# Altium schematic sheet Power.SchDoc
size A4
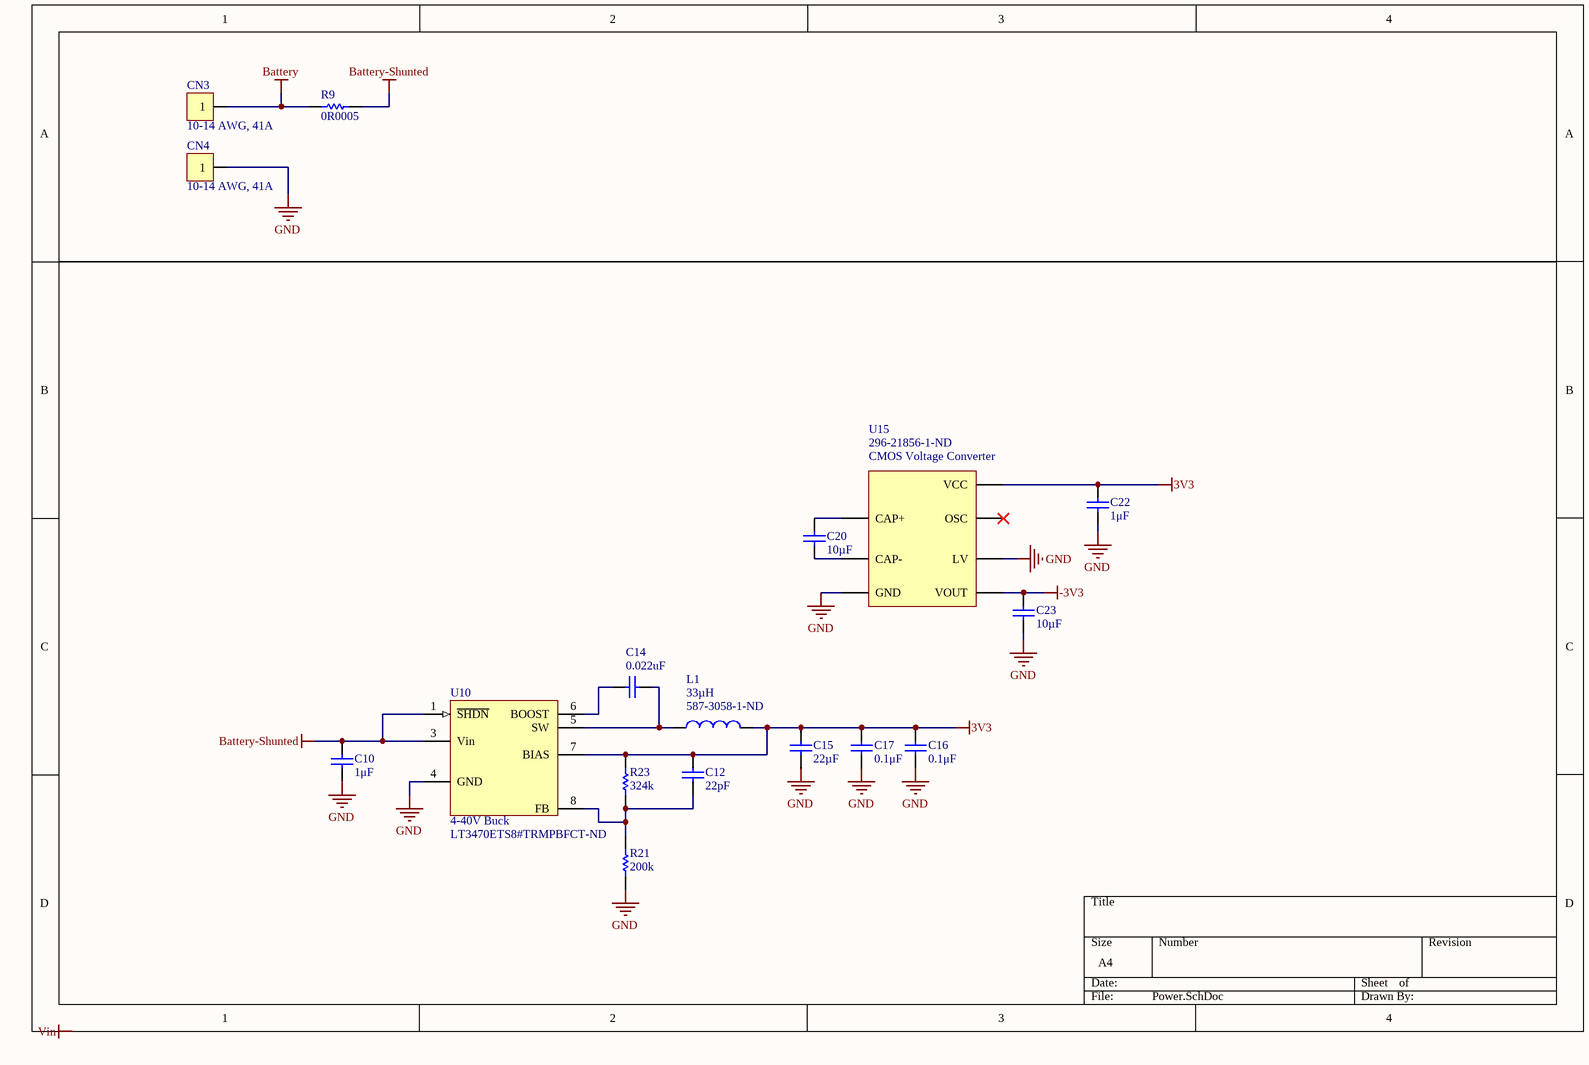
[diagram p0: Power.SchDoc]

## Parts
C10  1μF  [CAPC1608N(0603")]
C12  22pF  [CAPC1608N(0603")]
C14  0.022uF  [CAPC1608N(0603")]
C15  22µF  [CAPC2012N(0805")]
C16  0.1μF  [CAPC1608N(0603")]
C17  0.1μF  [CAPC1608N(0603")]
C20  10µF  [CAPC2012N(0805")]
C22  1μF  [CAPC1608N(0603")]
C23  10µF  [CAPC2012N(0805")]
CN3  10-14 AWG, 41A  [1x1, Phoenix Contact 1704837,THT]  (no BOM)
CN4  10-14 AWG, 41A  [1x1, Phoenix Contact 1704837,THT]  (no BOM)
L1  33µH  Supplier Part Number 1: 587-3058-1-ND  [CB - 1007 (2518)]
R9  0R0005  [RESC6332N(2512")]
R21  200k  [RESC1608N(0603")]
R23  324k  [RESC1608N(0603")]
U10  4-40V Buck  Supplier Part Number 1: LT3470ETS8#TRMPBFCT-ND  [TSOT-23-8]
U15  CMOS Voltage Converter  Supplier Part Number 1: 296-21856-1-ND  [8-SOIC]

## Nets
3V3: C12.1 C15.2(Cathode) C16.1(Anode) C17.1(Anode) C22.2(Cathode) L1.2 R23.2 U10.7(BIAS) U15.8(VCC)
-3V3: C23.2(Cathode) U15.5(VOUT)
Battery: CN3.1 R9.1
Battery-Shunted: C10.2(Cathode) R9.2 U10.1(~{SHDN}) U10.3(Vin)
GND: C10.1(Anode) C15.1(Anode) C16.2(Cathode) C17.2(Cathode) C22.1(Anode) C23.1(Anode) CN4.1 R21.1 U10.4(GND) U15.3(GND) U15.6(LV)
NetC12_2: C12.2 R21.2 R23.1 U10.8(FB)
NetC14_1: C14.1 U10.6(BOOST)
NetC14_2: C14.2 L1.1 U10.5(SW)
NetC20_1: C20.1(Anode) U15.4(CAP-)
NetC20_2: C20.2(Cathode) U15.2(CAP+)

Not connected (* = marked no-connect by the designer): U15 7(OSC)*

## Notes on the sheet
- Labels drawn without touching a wire or pin: Vin

## Library data of the parts
C10 C22 = 1uF 25V 0603 SMD, Ceramic: Capacitor, Ceramic, 25V, +/- 10%, 0603 SMD, X5R; MFG: Murata-Electronics-North-America; MFG#: GRM188R61E105KA12D; Published: 16-06-27; Publisher: AUVic; PackageDescription: Chip Capacitor; Value: 1μF; Created By: Andy Bates; Supplier 1: Digi-Key; Supplier Part Number 1: 490-3897-1-ND
C12 = 22pF 50V 0603 SMD, Ceramic: Capacitor, Ceramic, 50V, +/-5%, 0603 SMD, X7R; Value: 22pF; Created By: Andy Bates; Created On: 2017-10-22; Supplier 1: Digi-Key; Supplier Part Number 1: 478-1167-1-ND
C14 = 0.022uF 50V 0603 SMD, Ceramic: Capacitor, Ceramic, 50V, +/-10%, 0603 SMD, X7R; Value: 0.022uF; Created By: Andy Bates; Created On: 2017-10-22; Supplier 1: Digi-Key; Supplier Part Number 1: 1276-1104-1-ND
C15 = 22uF 35V 0805 SMD, Ceramic: Capacitor, Ceramic, 35V, +/- 20%, 0805 SMD, X5R; Published: 14-06-01; Publisher: AUVic; PackageDescription: Chip Capacitor; Value: 22µF; Supplier 1: Digi-Key; Supplier Part Number 1: 445-14428-1-ND
C16 C17 = 0.1uF 100V 0603 SMD, Ceramic: Capacitor, Ceramic, 100V, +/- 10%, 0603 SMD, X7R; MFG: TDK; MFG#: CGA3E3X7S2A104K080AB; Published: 16-04-26; Publisher: AUVic; PackageDescription: Chip Capacitor; Value: 0.1μF; Created By: Ashwin Sira; Supplier 1: Digi-Key; Supplier Part Number 1: 445-6938-1-ND
C20 C23 = 10uF 10V 0805 SMD, Ceramic: Capacitor, Ceramic, 10V, +/- 10%, 0805 SMD, X5R; Made By: Andy Bates; Published: 14-06-23; Publisher: AUVic; PackageDescription: Chip Capacitor; Value: 10µF; Supplier 1: Digi-Key; Supplier Part Number 1: 490-4735-1-ND
CN3 CN4 = 1x1, Phoenix Contact 1704837,THT: Publisher: Andy Bates; Date Published: 2018-01-21; Last Updated: *; Reviewed By: *; Supplier 1: Digi-Key; Supplier Part Number 1: 277-10194-1-ND
L1 = 33µH 270mA 1.95Ohm: Value: 33µH; Created By: Andy Bates; Created On: 2017-06-05; Supplier 1: Digi-Key
R9 = 0R0005, 1%, 3W, 2512 SMD: MFG: Riedon; MFG#: CSR2512C0R0005F; Last_Revision_By: Ashwin Sira; Last_Revision_Note: Made; Created By: Ashwin Sira; Created On: 2016-04-28; Value: 0R0005; Publisher: AUVic; Last_Revision_Date: 2016-04-28; Supplier 1: Digi-Key; Supplier Part Number 1: 696-1183-1-ND
R21 = 200kR, 1%, 1/10W, 0603 SMD: Made By: Ashwin Sira; Owned By: AUVic; Created On: 14-07-10; Value: 200k; Supplier 1: Digi-Key; Supplier Part Number 1: 541-200KHCT-ND
R23 = 324kR, 1%, 1/10W, 0603 SMD: Made By: Andy Bates; Owned By: AUVic; Created On: 14-05-31; Last Edited: 14-05-31; Value: 324k; Supplier 1: Digi-Key; Supplier Part Number 1: 311-324KHRCT-ND
U10 = LT3470ETS8#TRMPBF: Low Noise Step-Down Switching Regulator, 123-8-pin TSOT, 0 to 85 degC; Manufacturer: Linear Technology; Number of Outputs: 1; RoHS: TRUE; Mounting Technology: Surface Mount; ComponentLink2Description: Datasheet; Supplier 1: Digi-Key
U15 = TL7660: LatestRevisionDate: 17-Jul-2002; LatestRevisionNote: Re-released for DXP Platform.; Publisher: Altium Limited; Created By: Jordan; Manufacturer Part No.: TL7660; Supplier 1: Digi-Key